# EAGLE design CAN_ProtoBoard_home_th (EAGLE 7.2.0)
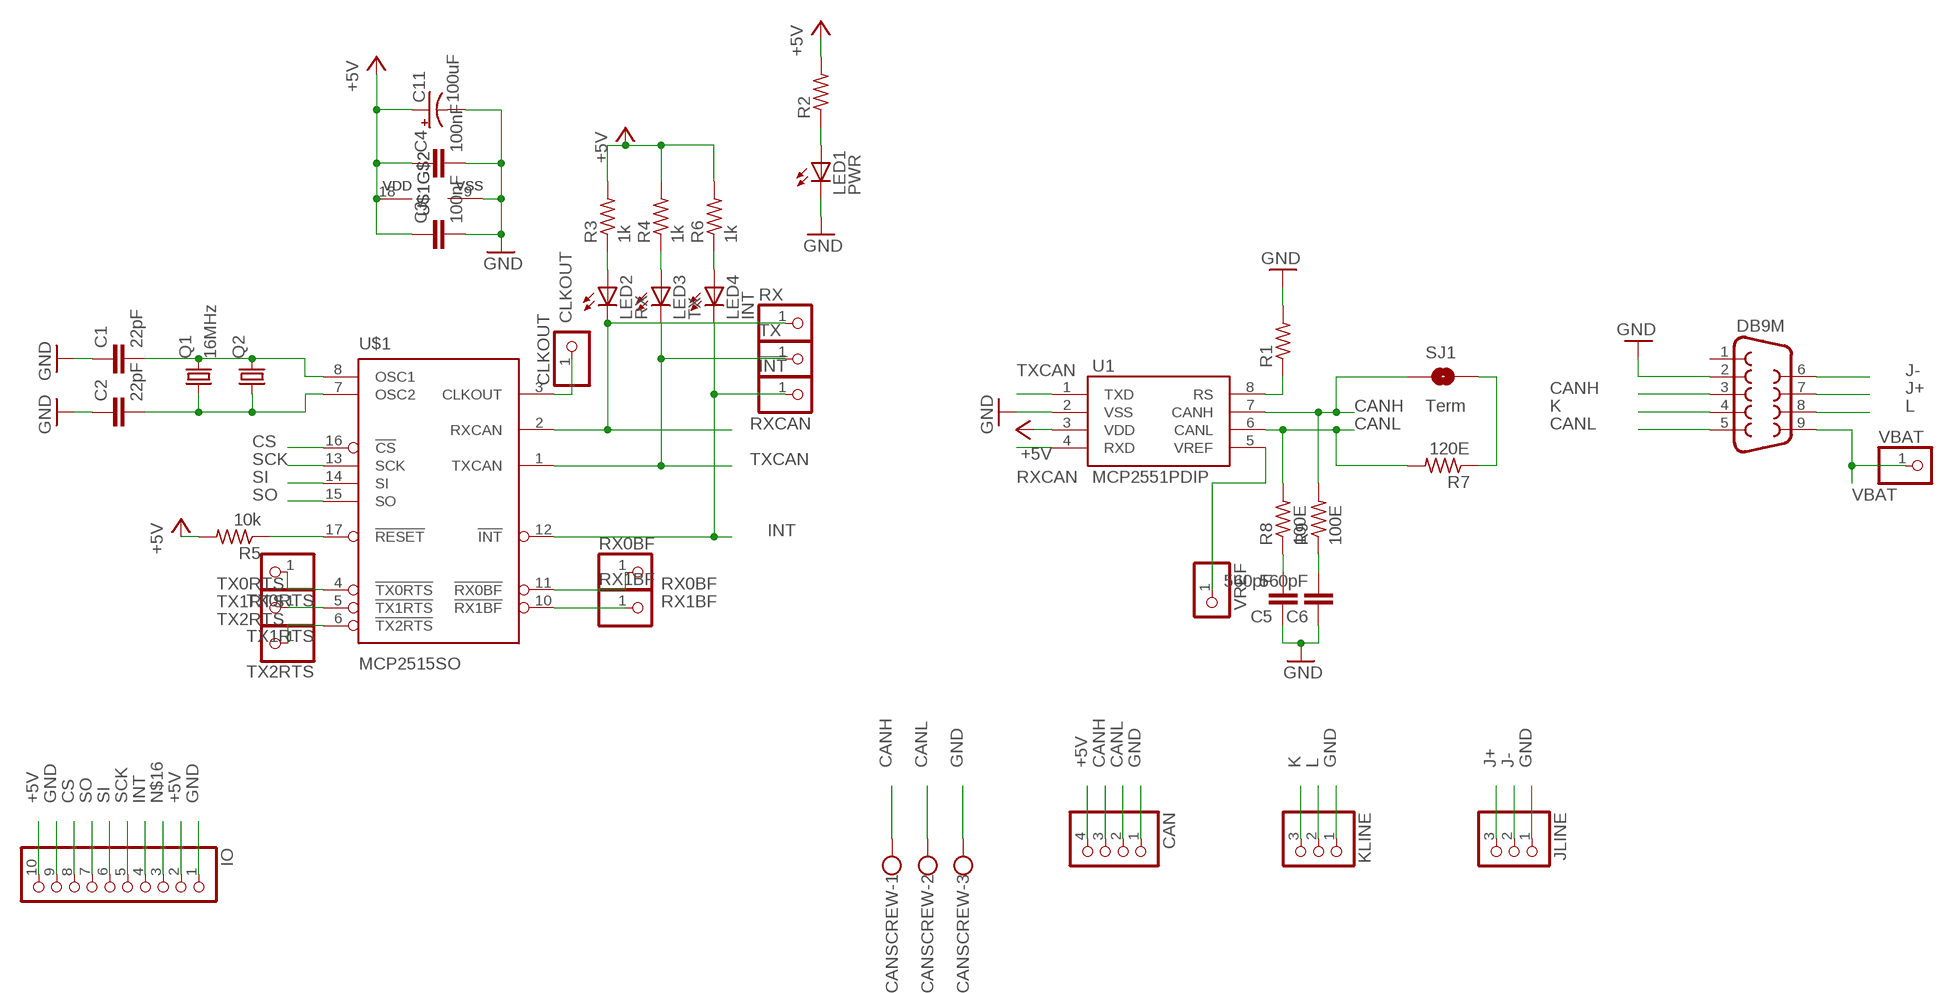
[diagram p0: schematic, sheet 1]

## Parts
!INT  PINHD-1X1  [1X01]
C1  22pF  C-EUC0805K  [C0805K]
C2  22pF  C-EUC0805K  [C0805K]
C3  100nF  C-EUC0805K  [C0805K]
C4  100nF  C-EUC0805K  [C0805K]
C5  560pF  C-EUC0805K  [C0805K]
C6  560pF  C-EUC0805K  [C0805K]
C11  100uF  CPOL-USD  [PANASONIC_D]
CAN  PINHD-1X4  [1X04]
CANSCREW  W237-103  [W237-103]
CLKOUT  PINHD-1X1  [1X01]
DB9M  DB9MALE  [DB9_MALE]
IO  PINHD-1X10  [1X10]
JLINE  PINHD-1X3  [1X03]
KLINE  PINHD-1X3  [1X03]
LED1  PWR  LEDCHIPLED_0805  [CHIPLED_0805]
LED2  RX  LEDCHIPLED_0805  [CHIPLED_0805]
LED3  TX  LEDCHIPLED_0805  [CHIPLED_0805]
LED4  INT  LEDCHIPLED_0805  [CHIPLED_0805]
Q1  16MHz  CRYSTALHC49S  [HC49/S]
Q2  CRYSTALHC49UP  [HC49UP]
R1  R-US_R0805  [R0805]
R2  R-US_R0805  [R0805]
R3  1k  R-US_R0805  [R0805]
R4  1k  R-US_R0805  [R0805]
R5  10k  R-US_R0805  [R0805]
R6  1k  R-US_R0805  [R0805]
R7  120E  R-US_R0805  [R0805]
R8  100E  R-US_R0805  [R0805]
R9  100E  R-US_R0805  [R0805]
RX  PINHD-1X1  [1X01]
RX0BF  PINHD-1X1  [1X01]
RX1BF  PINHD-1X1  [1X01]
SJ1  Term  SOLDERJUMPERTRACE  [SJ_2S-TRACE]
TX  PINHD-1X1  [1X01]
TX0RTS  PINHD-1X1  [1X01]
TX1RTS  PINHD-1X1  [1X01]
TX2RTS  PINHD-1X1  [1X01]
U1  MCP2551PDIP  [DIL08]
U$1  MCP2515SO  [SO-18W]
VBAT  PINHD-1X1  [1X01]
VREF  PINHD-1X1  [1X01]

## Nets
+5V: C3.1 C4.1 C11.+ CAN.4 IO.2 IO.10 R2.2 R3.2 R4.2 R5.2 R6.2 U1.3(VDD) U$1.18(VDD)
CANH: CAN.3 CANSCREW.1 DB9M.3 R9.2 SJ1.1 U1.7(CANH)
CANL: CAN.2 CANSCREW.2 DB9M.5 R7.2 R8.2 U1.6(CANL)
CLKOUT: CLKOUT.1 U$1.3(CLKOUT)
CS: IO.8 U$1.16(!CS)
GND: C1.1 C2.1 C3.2 C4.2 C5.1 C6.1 C11.- CAN.1 CANSCREW.3 DB9M.2 IO.1 IO.9 JLINE.1 KLINE.1 LED1.C R1.2 U1.2(VSS) U$1.9(VSS)
INT: !INT.1 IO.4 LED4.C U$1.12(!INT)
J+: DB9M.7 JLINE.3
J-: DB9M.6 JLINE.2
K: DB9M.4 KLINE.3
L: DB9M.8 KLINE.2
N$1: C1.2 Q1.2 Q2.2 U$1.8(OSC1)
N$2: C2.2 Q1.1 Q2.1 U$1.7(OSC2)
N$3: LED2.A R3.1
N$4: LED3.A R4.1
N$5: R5.1 U$1.17(!RESET)
N$6: LED1.A R2.1
N$7: LED4.A R6.1
N$9: R7.1 SJ1.2
N$11: C5.2 R8.1
N$12: C6.2 R9.1
N$16: IO.3
RS: R1.1 U1.8(RS)
RX0BF: RX0BF.1 U$1.11(!RX0BF)
RX1BF: RX1BF.1 U$1.10(!RX1BF)
RXCAN: LED2.C RX.1 U1.4(RXD) U$1.2(RXCAN)
SCK: IO.5 U$1.13(SCK)
SI: IO.6 U$1.14(SI)
SO: IO.7 U$1.15(SO)
TX0RTS: TX0RTS.1 U$1.4(!TX0RTS)
TX1RTS: TX1RTS.1 U$1.5(!TX1RTS)
TX2RTS: TX2RTS.1 U$1.6(!TX2RTS)
TXCAN: LED3.C TX.1 U1.1(TXD) U$1.1(TXCAN)
VBAT: DB9M.9 VBAT.1
VREF: U1.5(VREF) VREF.1
Unconnected: DB9M.1

## Library data of the parts
!INT CLKOUT RX RX0BF RX1BF TX TX0RTS TX1RTS TX2RTS VBAT VREF = pinhead:PINHD-1X1: PIN HEADER
C1-C6 = resistor:C-EU: CAPACITOR, European symbol
C11 = resistor:CPOL-US: POLARIZED CAPACITOR, American symbol
CAN = pinhead:PINHD-1X4: PIN HEADER
CANSCREW = con-wago-500:W237-103: WAGO SCREW CLAMP; MPN: 237-103; OC_FARNELL: unknown; OC_NEWARK: 18M7116
DB9M = SparkFun-Connectors:DB9: DB9 Connector Standard DB9 (D-Sub 9) serial connector. Can be used for CAN bus as well as RS485 and RS232. Footprint production proven. Spark Fun Electronics SKU : PRT-00429; PROD_ID: CONN-09904
IO = pinhead:PINHD-1X10: PIN HEADER
JLINE KLINE = pinhead:PINHD-1X3: PIN HEADER
LED1-LED4 = led:LED: LED OSRAM: - CHIPLED LG R971, LG N971, LY N971, LG Q971, LY Q971, LO R971, LY R971 LH N974, LH R974 LS Q976, LO Q976, LY Q976 LO Q996 - Hyper CHIPLED LW Q18S LB Q993, LB Q99A, LB R99A - SideLED LS A670, LO A670, LY A670, LG A670, LP A670 LB A673, LV A673, LT A673, LW A673 LH A674 LY A675 LS A676, LA A676, LO A676, LY A676, LW A676 LS A679, LY A679, LG A679 - Hyper Micro SIDELED® LS Y876, LA Y876, LO Y876, LY Y876 LT Y87S - SmartLED LW L88C, LW L88S LB L89C, LB L89S, LG L890 LS L89K, LO L89K, LY L89K LS L896, LA L896, LO L896, LY L896 - TOPLED LS T670, LO T670, LY T670, LG T670, LP T670 LSG T670, LSP T670, LSY T670, LOP T670, LYG T670 LG T671, LOG T671, LSG T671 LB T673, LV T673, LT T673, LW T673 LH T674 LS T676, LA T676, LO T676, LY T676, LB T676, LH T676, LSB T676, LW T676 LB T67C, LV T67C, LT T67C, LS T67K, LO T67K, LY T67K, LW E67C LS E67B, LA E67B, LO E67B, LY E67B, LB E67C, LV E67C, LT E67C LW T67C LS T679, LY T679, LG T679 LS T770, LO T770, LY T770, LG T770, LP T770 LB T773, LV T773, LT T773, LW T773 LH T774 LS E675, LA E675, LY E675, LS T675 LS T776, LA T776, LO T776, LY T776, LB T776 LHGB T686 LT T68C, LB T68C - Hyper Mini TOPLED® LB M676 - Mini TOPLED Santana® LG M470 LS M47K, LO M47K, LY M47K Source: http://www.osram.convergy.de LUXEON: - LUMILED® LXK2-PW12-R00, LXK2-PW12-S00, LXK2-PW14-U00, LXK2-PW14-V00 LXK2-PM12-R00, LXK2-PM12-S00, LXK2-PM14-U00 LXK2-PE12-Q00, LXK2-PE12-R00, LXK2-PE12-S00, LXK2-PE14-T00, LXK2-PE14-U00 LXK2-PB12-K00, LXK2-PB12-L00, LXK2-PB12-M00, LXK2-PB14-N00, LXK2-PB14-P00, LXK2-PB14-Q00 LXK2-PR12-L00, LXK2-PR12-M00, LXK2-PR14-Q00, LXK2-PR14-R00 LXK2-PD12-Q00, LXK2-PD12-R00, LXK2-PD12-S00 LXK2-PH12-R00, LXK2-PH12-S00 LXK2-PL12-P00, LXK2-PL12-Q00, LXK2-PL12-R00 Source: www.luxeon.com KINGBRIGHT: KA-3528ASYC Source: www.kingbright.com
Q1 = crystal:CRYSTAL: CRYSTAL; OC_FARNELL: 1667008; OC_NEWARK: unknown
Q2 = crystal:CRYSTAL: CRYSTAL; OC_FARNELL: unknown; OC_NEWARK: unknown
R1-R9 = resistor:R-US_: RESISTOR, American symbol
SJ1 = SparkFun-Retired:SOLDERJUMPER: Solder Jumper Standard SMD solder jumper. Used to automate production. Two varients : Normally Open and Normally Closed are the same, but have different paste layers. NC will have a large amount of paste and should jumper during reflow.
U1 = RobThePyro:MCP2551: CAN transceiver
U$1 = RobThePyro:MCP2515: MCP2515 CAN Controller by Microchip

## Board
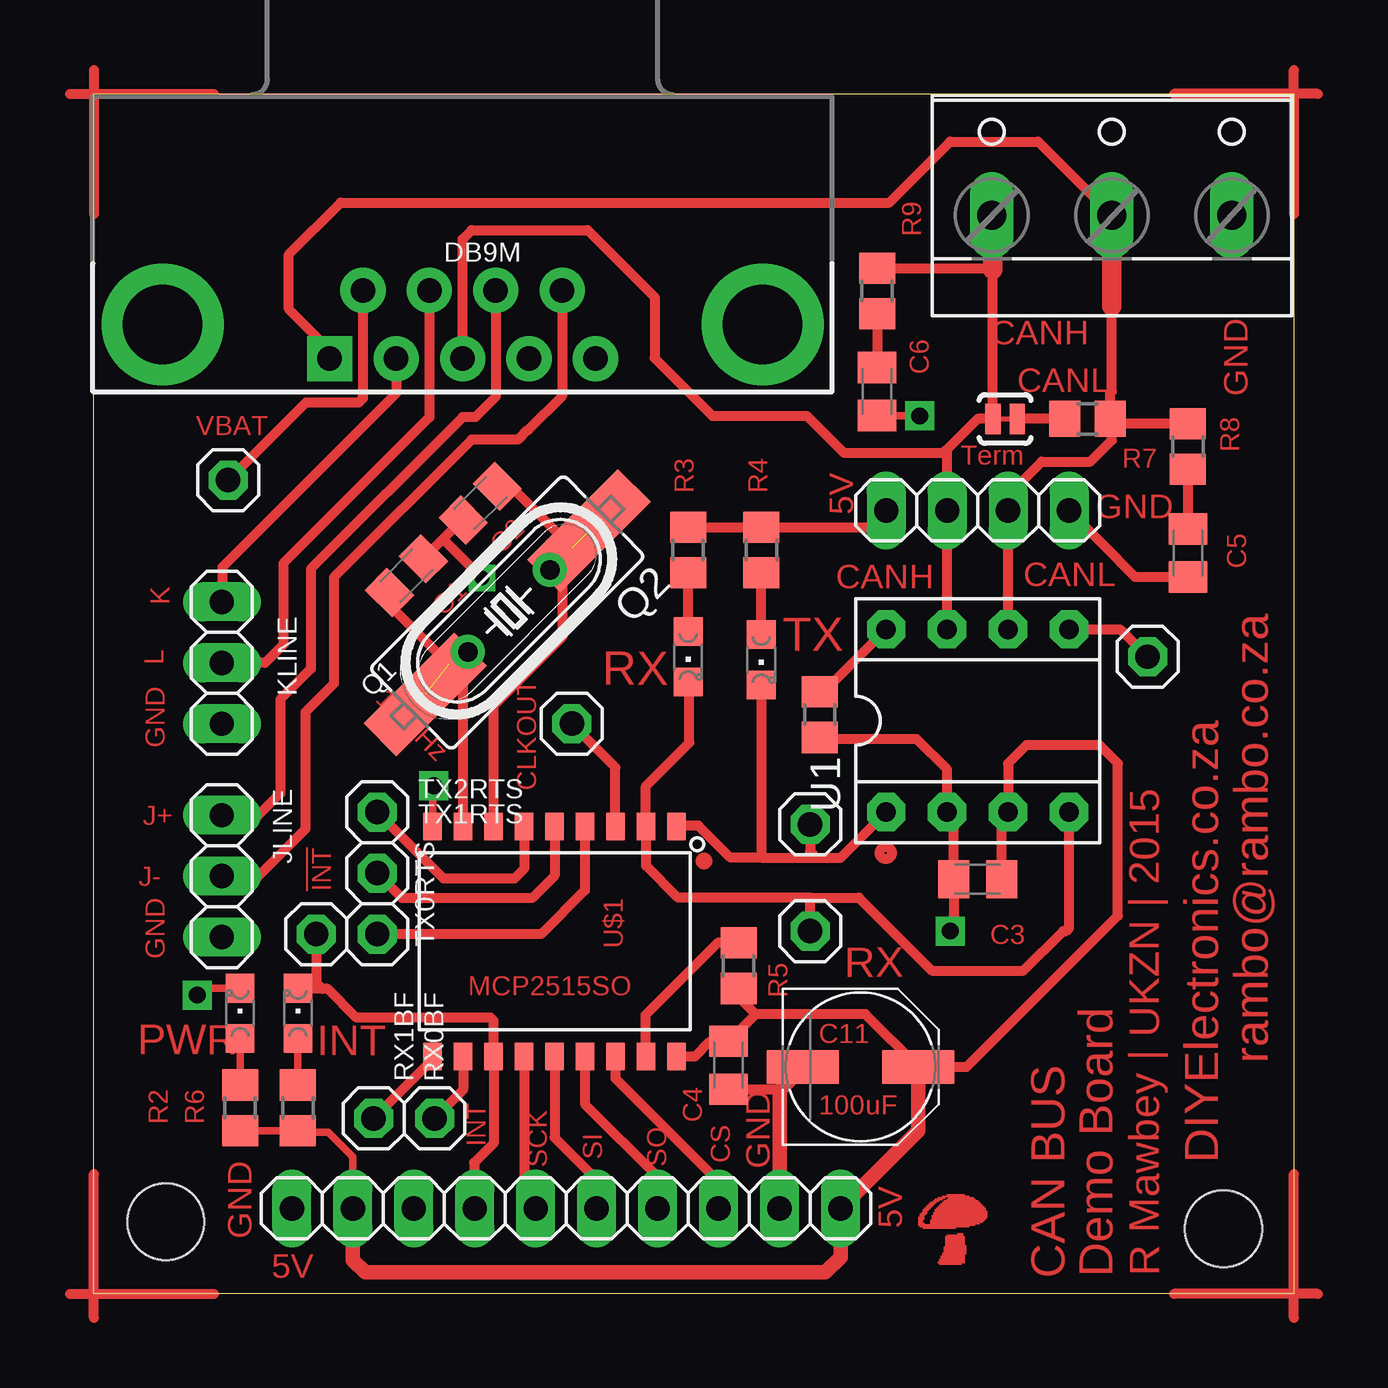
[diagram p1: board, top side]
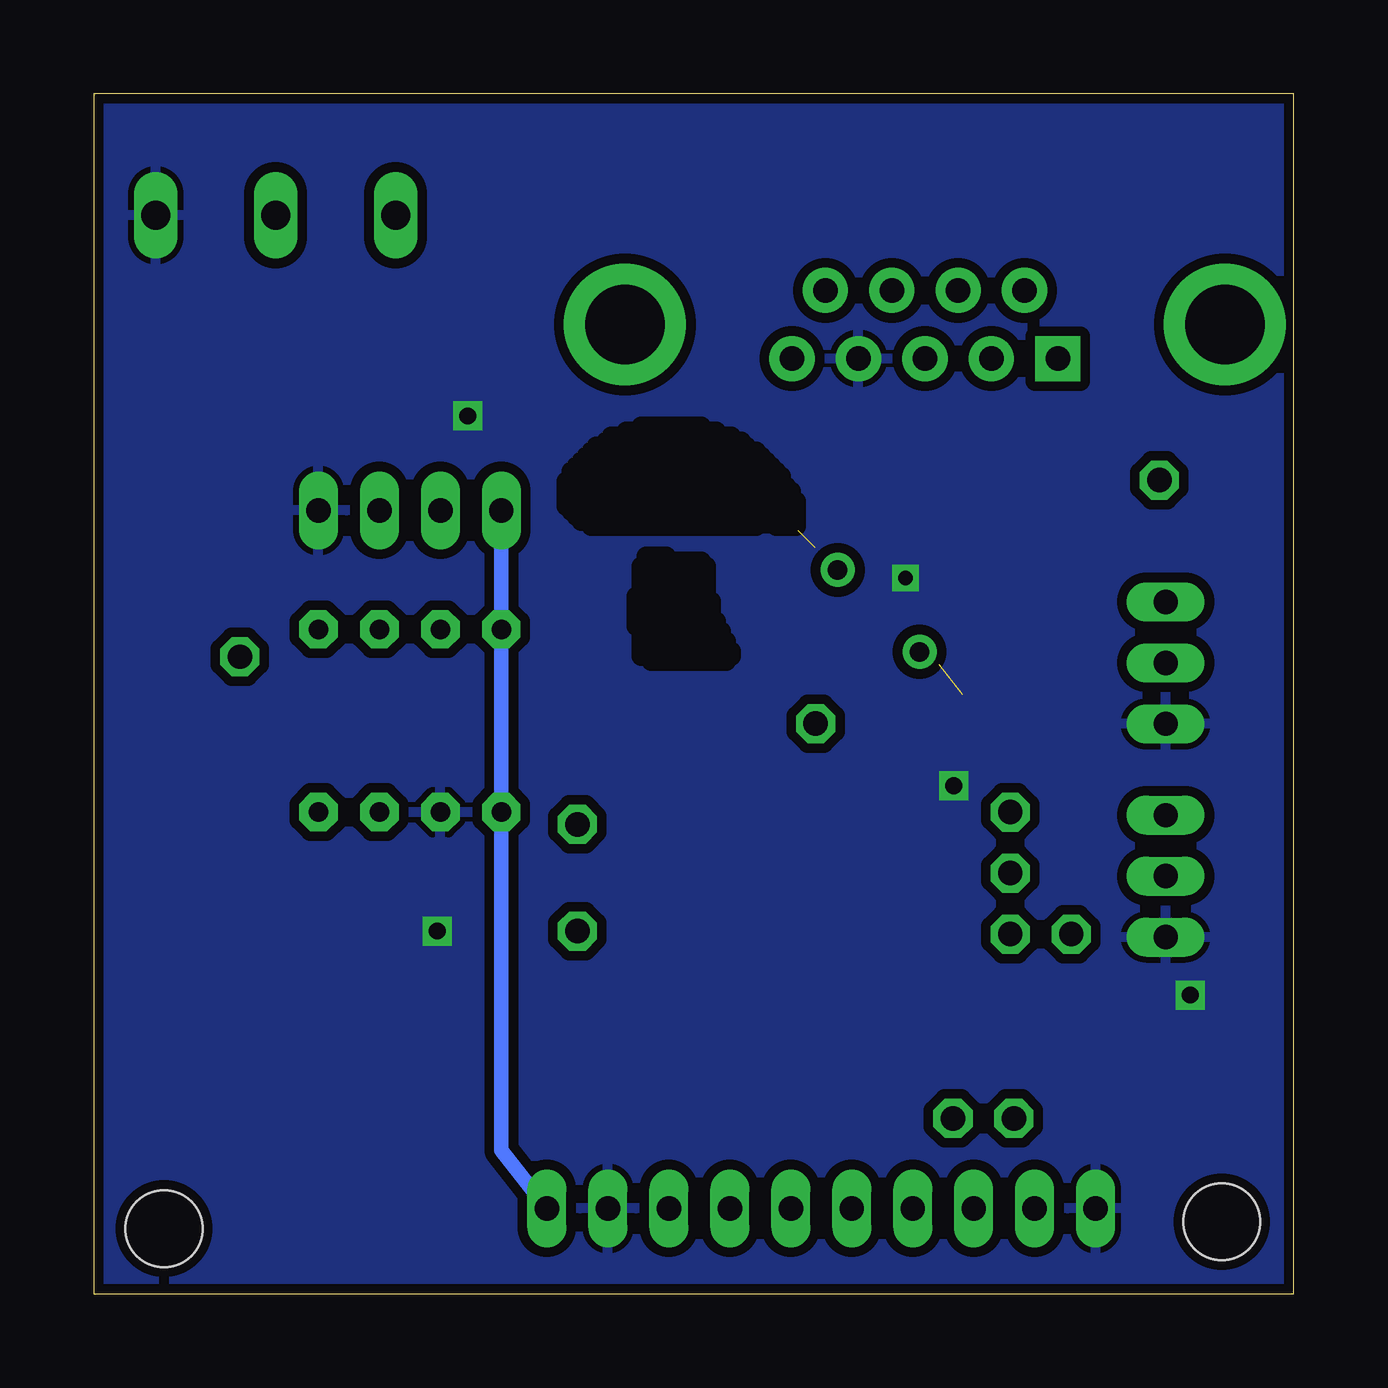
[diagram p2: board, bottom side, seen from below]

Size 50 x 50 mm. Coordinates in mm from the lower left corner, seen from the top.
Outline: 0,0 0,50 50,50 50,0 0,0
Copper layers (1*16): Top 0.035mm / dielectric 1.5mm / Bottom 0.035mm
Design rules "SparkFun": minimum track width 8mil, minimum drill 20mil, track to track 8mil, track to pad 8mil, pad to pad 8mil, via to via 8mil, smd to smd 8mil, copper to edge 10mil, drill to drill 8mil, minimum pad ring 12mil, minimum via ring 10mil, stop-mask expansion 4mil, vias tented up to drill 25mil, thermal gap 10mil
Holes 3.2 mm at 3,3 47.07,2.71
bRestrict: area 23.6,26.4 to 26.8,26.6; area 23.4,26.6 to 27.2,26.8; area 23.6,26.8 to 27.2,27; area 23.6,27 to 27.2,27.2; area 23.9,27.2 to 27.2,27.4; area 23.9,27.4 to 27.2,27.6; area 24.1,27.6 to 27.2,27.8; area 24.1,27.8 to 27.4,28; area 24.3,28 to 27.4,28.2; area 24.3,28.2 to 27.4,28.4; area 24.3,28.4 to 27.4,28.6; area 24.3,28.6 to 27.4,28.9; 47 more areas

### Footprints (pad centres in the part's own frame; a part is rotated, then mirrored left to right if it is on the bottom)
1X01 = drill 1.016 octagon: 1 0,0
C0805K = smd 1.3 x 1.6: 1 -1,0; 2 1,0
PANASONIC_D = smd 3 x 1.4: + 2.4,0; - -2.4,0
1X04 = drill 1.016 long: 1 -3.81,0; 2 -1.27,0; 3 1.27,0; 4 3.81,0
W237-103 = drill 1.194 long: 1 -5,-1.29; 2 0,-1.29; 3 5,-1.29
DB9_MALE = drill 1.016 pad 1.88: 1 5.54,-1.42; 2 2.77,-1.42; 3 0,-1.42; 4 -2.77,-1.42; 6 4.15,1.42; 7 1.38,1.42; 8 -1.38,1.42; 9 -4.15,1.42 | drill 1.016 pad 1.88 square: 5 -5.54,-1.42 | drill 3.302 pad 5.08: G1 -12.5,0; G2 12.5,0
1X10 = drill 1.016 long: 1 -11.43,0; 2 -8.89,0; 3 -6.35,0; 4 -3.81,0; 5 -1.27,0; 6 1.27,0; 7 3.81,0; 8 6.35,0; 9 8.89,0; 10 11.43,0
1X03 = drill 1.016 long: 1 -2.54,0; 2 0,0; 3 2.54,0
CHIPLED_0805 = smd 1.2 x 1.2: A 0,-1.05; C 0,1.05
HC49/S = drill 0.813: 1 -2.413,0; 2 2.413,0
HC49UP = smd 5.334 x 1.93: 1 -4.826,0; 2 4.826,0
R0805 = smd 1.3 x 1.5: 1 -0.95,0; 2 0.95,0
SJ_2S-TRACE = smd 0.635 x 1.27: 1 -0.508,0; 2 0.508,0
DIL08 = drill 0.813 pad 1.6 octagon: 1 -3.81,-3.81; 2 -1.27,-3.81; 3 1.27,-3.81; 4 3.81,-3.81; 5 3.81,3.81; 6 1.27,3.81; 7 -1.27,3.81; 8 -3.81,3.81
SO-18W = smd 0.762 x 1.143: 1 -5.08,-4.788; 2 -3.81,-4.788; 3 -2.54,-4.788; 4 -1.27,-4.788; 5 0,-4.788; 6 1.27,-4.788; 7 2.54,-4.788; 8 3.81,-4.788; 9 5.08,-4.788; 10 5.08,4.788; 11 3.81,4.788; 12 2.54,4.788; 13 1.27,4.788; 14 0,4.788; 15 -1.27,4.788; 16 -2.54,4.788; 17 -3.81,4.788; 18 -5.08,4.788

### Placement (x,y rotation side)
!INT  9.27,14.99 0 top
C1  13.03,29.92 225 top
C2  16.11,32.94 45 top
C3  36.83,17.27 180 top
C4  26.45,9.53 270 top
C5  45.59,30.86 90 top
C6  32.64,37.59 90 top
C11  31.95,9.45 0 top
CAN  36.83,32.64 180 top
CANSCREW  42.42,46.23 0 top
CLKOUT  19.92,23.75 0 top
DB9M  15.37,40.39 0 top
IO  19.68,3.56 0 top
JLINE  5.33,17.4 90 top
KLINE  5.33,26.29 90 top
LED1  6.1,11.68 0 top
LED2  24.77,26.54 180 top
LED3  27.81,26.42 180 top
LED4  8.51,11.68 0 top
Q1  17.3,28.46 225 top
Q2  17.23,28.38 225 top
R1  30.25,24.13 270 top
R2  6.1,7.75 270 top
R3  24.77,30.99 90 top
R4  27.81,30.99 90 top
R5  26.87,13.67 270 top
R6  8.51,7.75 270 top
R7  41.4,36.45 0 top
R8  45.59,35.31 90 top
R9  32.64,41.78 90 top
RX  29.84,15.11 0 top
RX0BF  14.2,7.3 0 top
RX1BF  11.66,7.3 0 top
SJ1  37.97,36.45 0 top
TX  29.84,19.56 0 top
TX0RTS  11.81,14.99 0 top
TX1RTS  11.81,17.53 0 top
TX2RTS  11.81,20.07 0 top
U1  36.83,23.88 0 top
U$1  19.2,14.68 180 top
VBAT  5.6,33.9 0 top
VREF  43.91,26.54 0 top

### Tracks (layer width: path | path; a pad name or v marks a point on that pad's centre or on a via)
+5V
  Top 0.305: IO.2 10.79,5.71 9.78,6.73 8.57,6.73 R6.2 R2.2
  Top 0.406: R3.2 R4.2 32.32,31.94 CAN.4 | C4.1 26.77,10.53 | 27.58,11.65 32.15,11.65 C11.+ 36.37,9.45 42.67,15.75 42.67,22.1 41.91,22.86 38.86,22.86 38.1,22.1 U1.3 37.83,19.8 C3.1 | 27.58,11.65 C4.1 | R5.2 26.87,12.36 27.58,11.65 | U$1.18 25.06,9.89 25.65,10.49 26.42,10.49 C4.1
  Top 0.61: IO.2 10.79,1.4 11.3,0.89 30.48,0.89 31.11,1.52 IO.10 34.35,6.79 C11.+
  Bottom 0.61: CAN.4 33.02,5.97 IO.10
CANH
  Top 0.406: 35.56,35.18 CAN.3 U1.7 | R9.2 37.4,42.73 37.47,42.67 SJ1.1 36.83,36.45 35.56,35.18 | 35.56,35.18 35.43,35.05 31.24,35.05 29.72,36.58 25.78,36.58 23.37,38.99 23.37,41.53 20.57,44.32 15.75,44.32 15.37,43.94 DB9M.3
  Top 0.813: 37.47,42.67 37.47,44.89 CANSCREW.1
CANL
  Top 0.406: DB9M.5 9.83,39.32 8.13,41.02 8.13,43.31 10.29,45.47 33.15,45.47 35.69,48.01 39.35,48.01 CANSCREW.2 42.35,44.87 | R7.2 42.42,36.38 42.42,35.56 41.53,34.67 39.5,34.67 38.1,33.27 CAN.2 U1.6 | R8.2 42.55,36.26 R7.2 | R7.2 42.35,37.53 42.42,37.59 42.42,41.15
  Top 0.813: 42.42,41.15 CANSCREW.2
CLKOUT
  Top 0.406: U$1.3 21.74,21.94 CLKOUT.1
CS
  Top 0.406: U$1.16 21.74,8.97 26.06,4.65 26.06,3.58 IO.8
GND  (via drill 0.6, 0.7)
  Top 0.305: LED1.C 4.61,12.73 v4.32,12.45 | U$1.9 14.12,20.49 v14.16,21.17 | C6.1 34.4,36.59 v34.42,36.58
  Top 0.406: 26.04,8.38 C4.2 28.52,8.53 28.57,8.47 | 28.57,5.84 IO.9 | v35.69,15.11 35.83,15.26 C3.2 35.83,19.8 U1.2 35.56,21.84 34.29,23.11 30.32,23.11 R1.2 | C5.1 43.39,29.86 CAN.1 | C2.1 15.34,32.24 14.6,31.5 | 14.6,31.5 C1.1 | v16.18,29.82 14.6,31.39 14.6,31.5
  Top 0.61: C11.- 28.57,8.47 IO.9
  pour Bottom (isolate 0.406): 0,0 0,50.02 49.78,50.02 49.78,0
INT
  Top 0.406: IO.4 15.85,3.58 15.85,5.46 16.66,6.27 U$1.12 16.66,11.38 16.54,11.51 10.95,11.51 9.75,12.7 9.53,12.7 | 9.53,12.7 8.54,12.7 LED4.C | !INT.1 9.27,12.95 9.53,12.7
J+
  Top 0.406: JLINE.3 6.86,19.94 7.77,20.85 7.77,24.77 9.04,26.04 9.04,30.2 15.37,36.52 15.9,36.52 16.75,37.37 DB9M.7
J-
  Top 0.406: DB9M.6 19.52,37.4 18.11,35.99 18.09,35.99 17.68,35.59 15.75,35.59 10.01,29.84 10.01,25.43 8.81,24.23 8.81,19.36 6.86,17.4 JLINE.2
K
  Top 0.406: DB9M.4 12.6,37.51 5.36,30.28 5.36,28.85 KLINE.3
L
  Top 0.406: KLINE.2 7.14,26.29 7.9,27.05 7.9,30.43 13.99,36.52 DB9M.8
N$1  (1 unrouted)
  Top 0.406: U$1.8 15.39,26.55 Q1.2 15.08,26.24 14.78,26.24 12.32,28.7 C1.2
N$2  (1 unrouted)
  Top 0.406: Q1.1 19,31.29 | U$1.7 16.66,24.51 19.53,27.38 19.53,29.63 Q1.1 | C2.2 17.38,33.65 19.94,31.09 19.93,31.09 Q1.1
N$3
  Top 0.406: LED2.A R3.1
N$4
  Top 0.406: LED3.A R4.1
N$5
  Top 0.406: R5.1 26,14.62 22.99,11.61 22.99,9.91 U$1.17
N$6
  Top 0.305: R2.1 LED1.A
N$7
  Top 0.305: R6.1 LED4.A
N$9
  Top 0.406: R7.1 SJ1.2
N$11
  Top 0.406: R8.1 C5.2
N$12
  Top 0.406: R9.1 C6.2
N$13
  Top 0.406: 0,-1 0,5
N$14
  Top 0.406: -1,0 5,0
N$15
  Top 0.406: 50,-1 50,5
N$17
  Top 0.406: 51,0 45,0
N$18
  Top 0.406: 50,51 50,50 50,45
N$19
  Top 0.406: 51,50 45,50
N$20
  Top 0.406: 0,51 0,45
N$21
  Top 0.406: -1,50 5,50
RS
  Top 0.406: R1.1 30.41,25.08 U1.8
RX0BF
  Top 0.406: U$1.11 15.39,8.49 RX0BF.1
RX1BF
  Top 0.406: U$1.10 14.12,9.77 RX1BF.1
RXCAN
  Top 0.406: 29.84,16.51 31.88,16.51 34.92,13.46 38.73,13.46 40.39,15.11 40.51,15.11 40.64,15.24 U1.4 | RX.1 29.84,16.51 | 29.84,16.51 24.33,16.51 23.01,17.83 U$1.2 23.01,21.15 24.82,22.96 24.82,25.44 LED2.C
SCK
  Top 0.406: U$1.13 17.93,4.04 IO.5
SI
  Top 0.406: U$1.14 19.2,6.51 20.98,4.72 20.98,3.58 IO.6
SO
  Top 0.406: U$1.15 20.47,7.9 23.5,4.88 IO.7
TX0RTS
  Top 0.406: U$1.4 20.47,16.81 18.64,14.99 TX0RTS.1
TX1RTS
  Top 0.406: U$1.5 19.2,17.42 18.26,16.48 12.85,16.48 TX1RTS.1
TX2RTS
  Top 0.406: U$1.6 17.93,17.7 17.53,17.3 14.58,17.3 TX2RTS.1
TXCAN
  Top 0.406: 27.81,18.18 30.1,18.18 | TX.1 29.84,18.43 30.1,18.18 | LED3.C 27.81,18.18 | 27.81,18.18 26.53,18.18 25.2,19.51 24.32,19.51 U$1.1 | 30.1,18.18 31.13,18.18 U1.1
VBAT
  Top 0.406: 5.65,33.85 VBAT.1 8.84,37.13 11.05,37.13 11.22,37.3 DB9M.9
VREF
  Top 0.406: U1.5 42.77,27.69 VREF.1
(copper drawn outside any net)
  shapes: Top area x62, Top circle x2

### Text on the board
Top: CANH | GND | CANL | 5V | GND | CANH | K | CANL | rambo@rambo.co.za | L | GND | J+ | J- | GND | INT | SI | SCK | SO | CS | GND | DIYElectronics.co.za | 5V | GND | 5V | CAN BUS | Demo Board | R Mawbey | UKZN | 2015